# EAGLE schematic Downloader 1.3 (EAGLE 7.3.0)
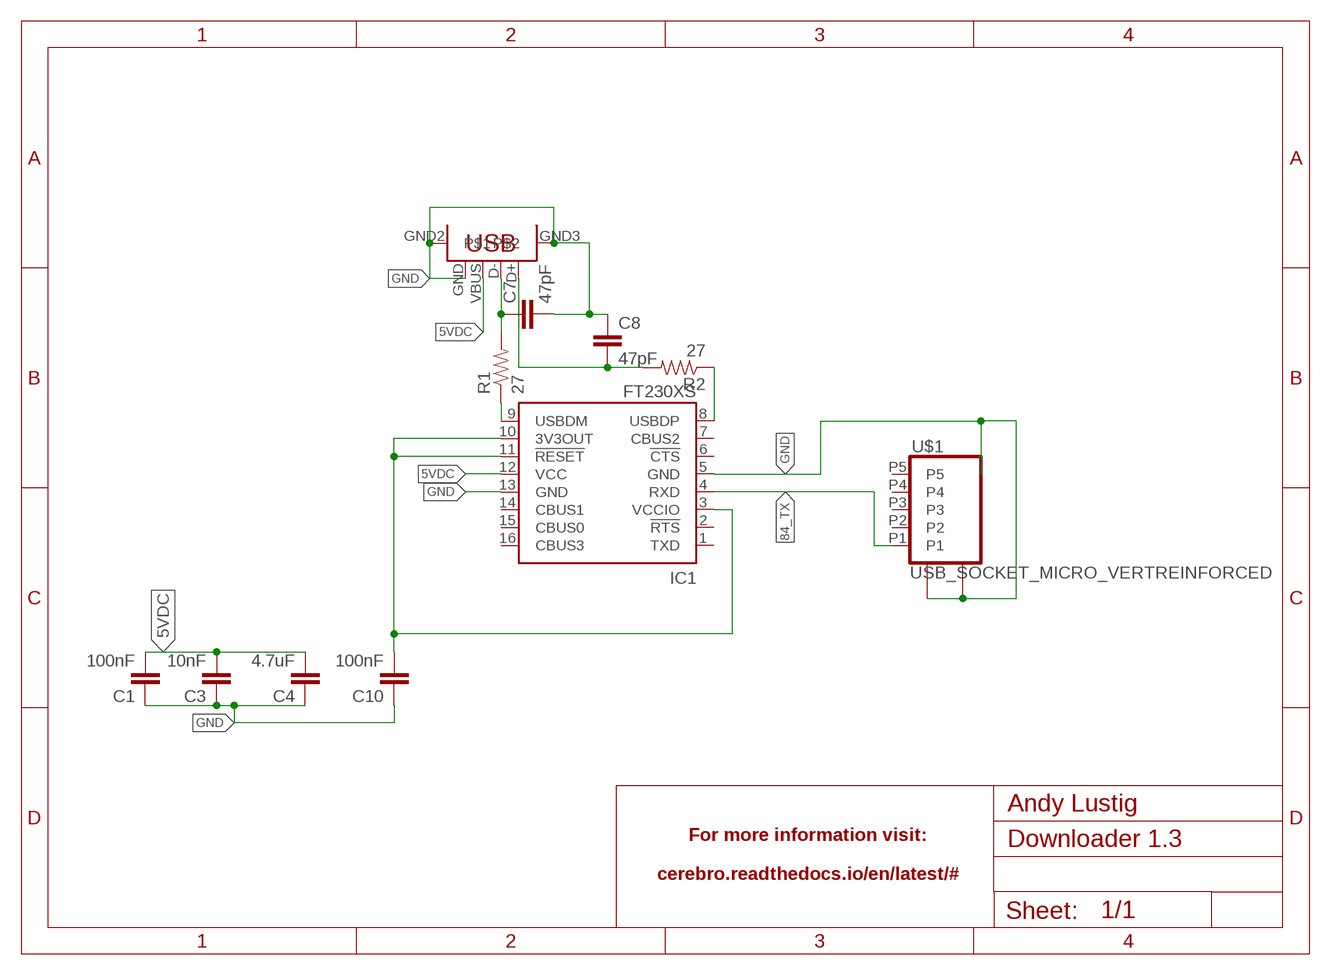
[diagram p0: schematic, sheet 1]

## Parts
C1  100nF  CAP0805  [0805]
C3  10nF  CAP0805  [0805]
C4  4.7uF  CAP0805  [0805]
C7  47pF  CAP0805  [0805]
C8  47pF  CAP0805  [0805]
C10  100nF  CAP0805  [0805]
IC1  FT230XS  [SSOP16]
JP1  USB-A-H  [USB-A-H]
R1  27  RESISTOR0805-RES  [0805]
R2  27  RESISTOR0805-RES  [0805]
U$1  USB_SOCKET_MICRO_VERTREINFORCED  [USB_HORZ_REINFORCED_MICRO]

## Nets
5VDC: C1.2 C3.2 C4.2 IC1.12(VCC) JP1.VBUS
84_TX: IC1.4(RXD) U$1.P1
D+: C8.2 JP1.D+ R2.2
GND: C1.1 C3.1 C4.1 C7.2 C8.1 C10.1 IC1.5(GND) IC1.13(GND) JP1.GND JP1.GND2 JP1.GND3 U$1.G1 U$1.G2 U$1.P$1 U$1.P$2
N$1: C7.1 JP1.D- R1.2
N$13: IC1.9(USBDM) R1.1
N$16: C10.2 IC1.3(VCCIO) IC1.10(3V3OUT) IC1.11(!RESET)
N$18: IC1.8(USBDP) R2.1
Unconnected: IC1.1(TXD) IC1.2(!RTS) IC1.6(!CTS) IC1.7(CBUS2) IC1.14(CBUS1) IC1.15(CBUS0) IC1.16(CBUS3) U$1.P2 U$1.P3 U$1.P4 U$1.P5

## Library data of the parts
C1 C3 C4 C7 C8 C10 = SparkFun-Passives:CAP: Capacitor Standard 0603 ceramic capacitor, and 0.1" leaded capacitor.
IC1 = ftdichip:FT230X: USB to BASIC UART IC Auto generated by make-symbol-device-package-bsdl.ulp Rev. 43 Source: Data sheet <http://www.ftdichip.com/Support/Documents/DataSheets/ICs/DS_FT230X.pdf>
JP1 = Andy-library:USB: USB Connectors USB-B-PTH is fully proven SKU : PRT-00139/CONN-08278 USB-miniB is fully proven SKU : PRT-00587 USB-A-PCB is untested. USB-A-H is throughly reviewed, but untested. Spark Fun Electronics SKU : PRT-00437 USB-B-SMT is throughly reviewed, but untested. Needs silkscreen touching up. USB-A-S has not been used/tested USB-MB-H has not been used/tested USB-MICROB has been used. CONN-09505
R1 R2 = Andy-library:RESISTOR: Resistor Basic schematic elements and footprints for 0603, 1206, and PTH resistors.
U$1 = Andy-library:USB_SOCKET_MICRO_VERT: horizontal socket. Digikey 609-4616-1-ND